# Altium project MCD_Rev2.PrjPcb
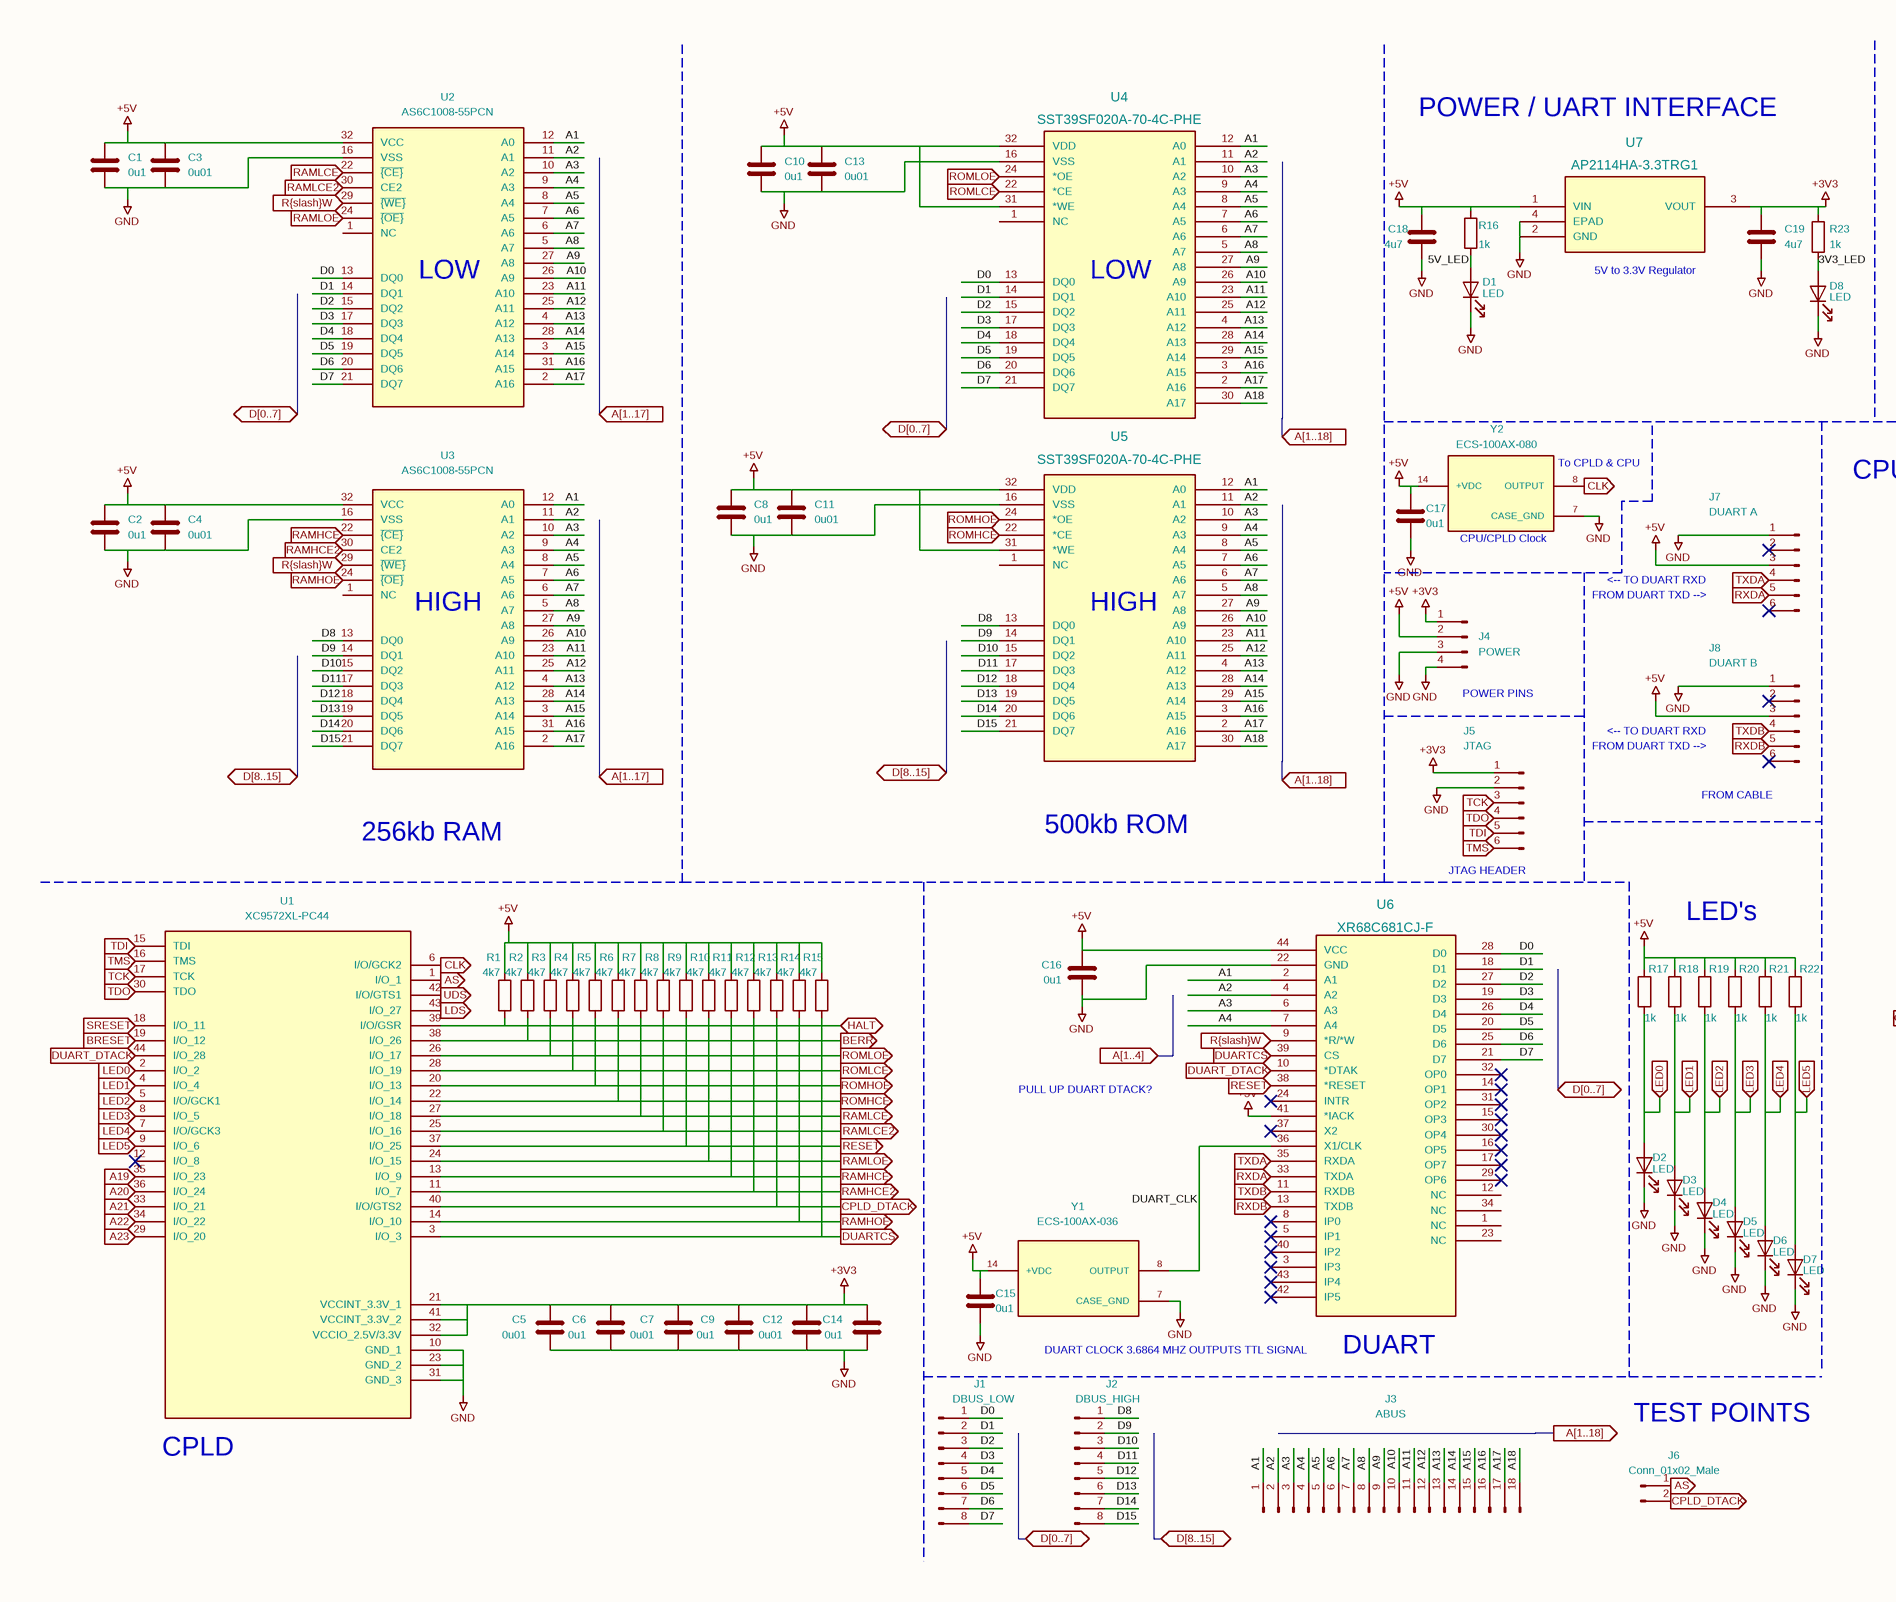
[diagram p0: MCD_Rev2.SchDoc, left]
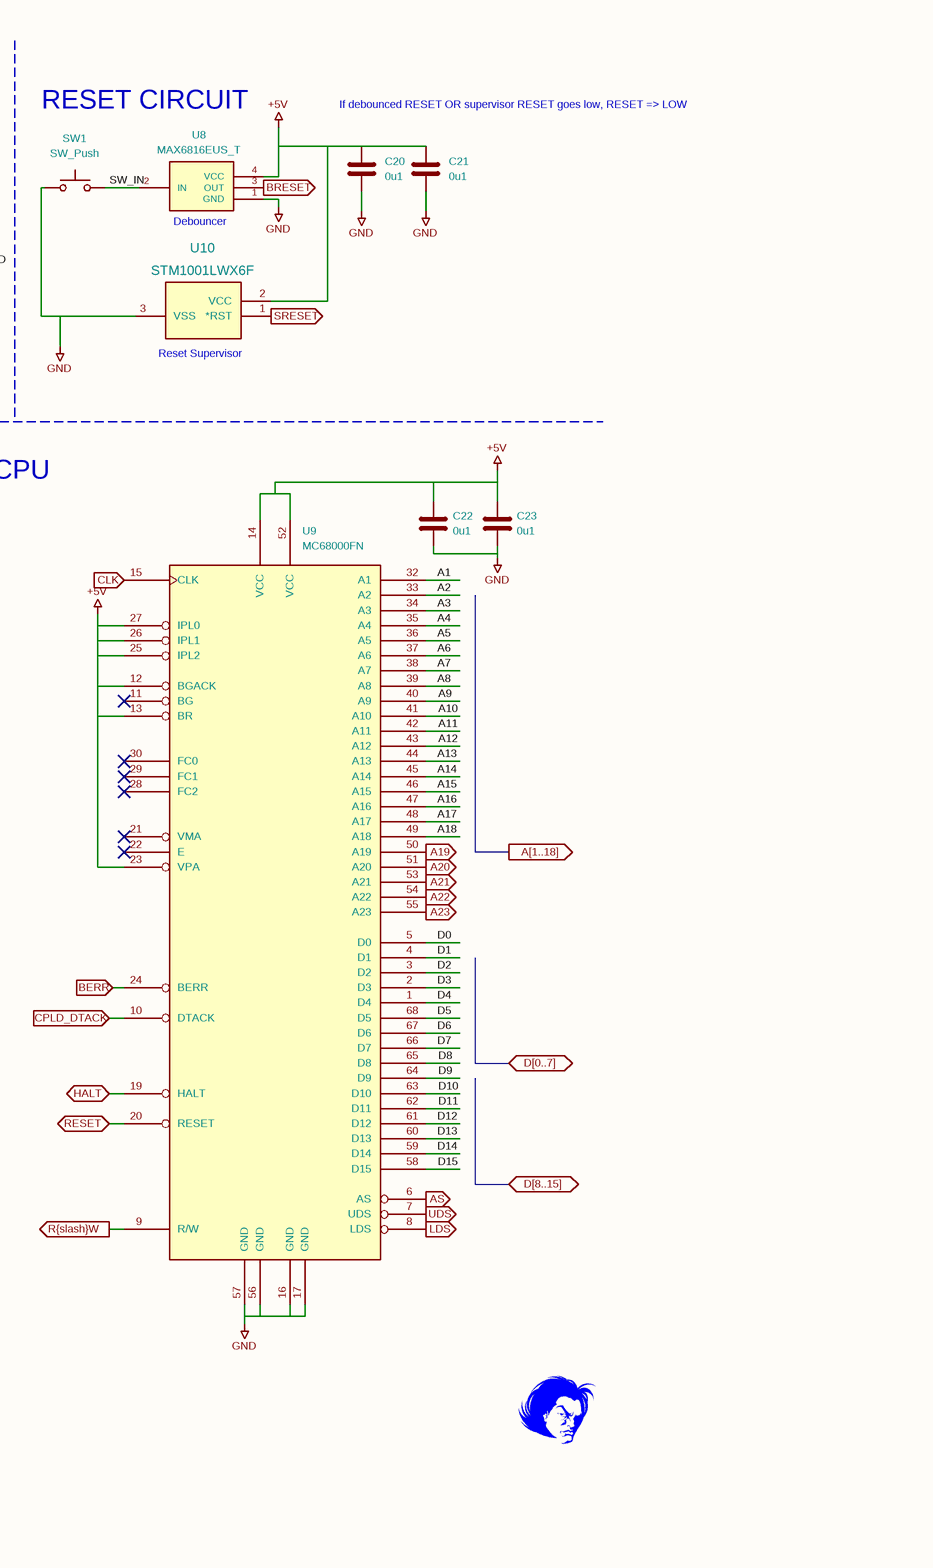
[diagram p1: MCD_Rev2.SchDoc, right]
1 sheet, 75 parts. Net scope: flat (ports and power ports of the same name join across sheets).
Board file: MCD_Rev2.PcbDoc

## Sheet MCD_Rev2.SchDoc
size 431 x 279 mm

### Parts
C1  0u1  [C_0805_2012Metric_Pad1.18x1.45mm_HandSolder]
C2  0u1  [C_0805_2012Metric_Pad1.18x1.45mm_HandSolder]
C3  0u01  [C_0805_2012Metric_Pad1.18x1.45mm_HandSolder]
C4  0u01  [C_0805_2012Metric_Pad1.18x1.45mm_HandSolder]
C5  0u01  [C_0805_2012Metric_Pad1.18x1.45mm_HandSolder]
C6  0u1  [C_0805_2012Metric_Pad1.18x1.45mm_HandSolder]
C7  0u01  [C_0805_2012Metric_Pad1.18x1.45mm_HandSolder]
C8  0u1  [C_0805_2012Metric_Pad1.18x1.45mm_HandSolder]
C9  0u1  [C_0805_2012Metric_Pad1.18x1.45mm_HandSolder]
C10  0u1  [C_0805_2012Metric_Pad1.18x1.45mm_HandSolder]
C11  0u01  [C_0805_2012Metric_Pad1.18x1.45mm_HandSolder]
C12  0u01  [C_0805_2012Metric_Pad1.18x1.45mm_HandSolder]
C13  0u01  [C_0805_2012Metric_Pad1.18x1.45mm_HandSolder]
C14  0u1  [C_0805_2012Metric_Pad1.18x1.45mm_HandSolder]
C15  0u1  [C_0805_2012Metric_Pad1.18x1.45mm_HandSolder]
C16  0u1  [C_0805_2012Metric_Pad1.18x1.45mm_HandSolder]
C17  0u1  [C_0805_2012Metric_Pad1.18x1.45mm_HandSolder]
C18  4u7  [C_0805_2012Metric_Pad1.18x1.45mm_HandSolder]
C19  4u7  [C_0805_2012Metric_Pad1.18x1.45mm_HandSolder]
C20  0u1  [C_0805_2012Metric_Pad1.18x1.45mm_HandSolder]
C21  0u1  [C_0805_2012Metric_Pad1.18x1.45mm_HandSolder]
C22  0u1  [C_0805_2012Metric_Pad1.18x1.45mm_HandSolder]
C23  0u1  [C_0805_2012Metric_Pad1.18x1.45mm_HandSolder]
D1  LED  [LED_0805_2012Metric_Pad1.15x1.40mm_HandSolder]
D2  LED  [LED_0805_2012Metric_Pad1.15x1.40mm_HandSolder]
D3  LED  [LED_0805_2012Metric_Pad1.15x1.40mm_HandSolder]
D4  LED  [LED_0805_2012Metric_Pad1.15x1.40mm_HandSolder]
D5  LED  [LED_0805_2012Metric_Pad1.15x1.40mm_HandSolder]
D6  LED  [LED_0805_2012Metric_Pad1.15x1.40mm_HandSolder]
D7  LED  [LED_0805_2012Metric_Pad1.15x1.40mm_HandSolder]
D8  LED  [LED_0805_2012Metric_Pad1.15x1.40mm_HandSolder]
J1  DBUS_LOW  [CON8_1X8_TU_HTS_SAI]
J2  DBUS_HIGH  [CON8_1X8_TU_HTS_SAI]
J3  ABUS  [CON18_2X9_TU_HTS_SAI]
J4  POWER  [CON4_1X4_TU_HTS_SAI]
J5  JTAG  [CON6_1X6_TU_HTS_SAI]
J6  Conn_01x02_Male  [CON2_1X2_TU_HTS_SAI]
J7  DUART A  [CON6_1X6_TU_HTS_SAI]
J8  DUART B  [CON6_1X6_TU_HTS_SAI]
R1  4k7  [R_0805_2012Metric_Pad1.20x1.40mm_HandSolder]
R2  4k7  [R_0805_2012Metric_Pad1.20x1.40mm_HandSolder]
R3  4k7  [R_0805_2012Metric_Pad1.20x1.40mm_HandSolder]
R4  4k7  [R_0805_2012Metric_Pad1.20x1.40mm_HandSolder]
R5  4k7  [R_0805_2012Metric_Pad1.20x1.40mm_HandSolder]
R6  4k7  [R_0805_2012Metric_Pad1.20x1.40mm_HandSolder]
R7  4k7  [R_0805_2012Metric_Pad1.20x1.40mm_HandSolder]
R8  4k7  [R_0805_2012Metric_Pad1.20x1.40mm_HandSolder]
R9  4k7  [R_0805_2012Metric_Pad1.20x1.40mm_HandSolder]
R10  4k7  [R_0805_2012Metric_Pad1.20x1.40mm_HandSolder]
R11  4k7  [R_0805_2012Metric_Pad1.20x1.40mm_HandSolder]
R12  4k7  [R_0805_2012Metric_Pad1.20x1.40mm_HandSolder]
R13  4k7  [R_0805_2012Metric_Pad1.20x1.40mm_HandSolder]
R14  4k7  [R_0805_2012Metric_Pad1.20x1.40mm_HandSolder]
R15  4k7  [R_0805_2012Metric_Pad1.20x1.40mm_HandSolder]
R16  1k  [R_0805_2012Metric_Pad1.20x1.40mm_HandSolder]
R17  1k  [R_0805_2012Metric_Pad1.20x1.40mm_HandSolder]
R18  1k  [R_0805_2012Metric_Pad1.20x1.40mm_HandSolder]
R19  1k  [R_0805_2012Metric_Pad1.20x1.40mm_HandSolder]
R20  1k  [R_0805_2012Metric_Pad1.20x1.40mm_HandSolder]
R21  1k  [R_0805_2012Metric_Pad1.20x1.40mm_HandSolder]
R22  1k  [R_0805_2012Metric_Pad1.20x1.40mm_HandSolder]
R23  1k  [R_0805_2012Metric_Pad1.20x1.40mm_HandSolder]
SW1  SW_Push  [SW_PUSH_6mm]
U1  XC9572XL-PC44  [TO_11B1-RK-TP_3MM]
U2  AS6C1008-55PCN  [PDIP32_PH_SST_MCH]
U3  AS6C1008-55PCN  [PDIP32_PH_SST_MCH]
U4  SST39SF020A-70-4C-PHE  [PDIP32_PH_SST_MCH]
U5  SST39SF020A-70-4C-PHE  [PDIP32_PH_SST_MCH]
U6  XR68C681CJ-F  [TO_11B1-RK-TP_3MM]
U7  AP2114HA-3.3TRG1  [SOT-223_DIO-L]
U8  MAX6816EUS_T  [SOT-143_Handsoldering]
U9  MC68000FN  [3M_8468-11B1-RK-TP]
U10  STM1001LWX6F  [SOT-23_STM-L]
Y1  ECS-100AX-036  [OSC_ECS-100AX-036]
Y2  ECS-100AX-080  [OSC_ECS-100AX-080]

### Ports
A19 (in), A19 (out), A20 (in), A20 (out), A21 (in), A21 (out), A22 (in), A22 (out), A23 (in), A23 (out), A[1..4] (in), A[1..17] (in), A[1..18] (in), A[1..18] (out), AS (in), AS (out), BERR (in), BERR (out), BRESET (in), BRESET (out), CLK (in), CLK (out), CPLD_DTACK (in), CPLD_DTACK (out), D[0..7] (bidir), D[8..15] (bidir), DUART_DTACK (in), DUART_DTACK (out), DUARTCS (in), DUARTCS (out), HALT (bidir), LDS (in), LDS (out), LED0 (in), LED0 (out), LED1 (in), LED1 (out), LED2 (in), LED2 (out), LED3 (in), LED3 (out), LED4 (in), LED4 (out), LED5 (in), LED5 (out), RAMHCE2 (in), RAMHCE2 (out), RAMHCE (in), RAMHCE (out), RAMHOE (in), RAMHOE (out), RAMLCE2 (in), RAMLCE2 (out), RAMLCE (in), RAMLCE (out), RAMLOE (in), RAMLOE (out), RESET (bidir), RESET (in), RESET (out), ROMHCE (in), ROMHCE (out), ROMHOE (in), ROMHOE (out), ROMLCE (in), ROMLCE (out), ROMLOE (in), ROMLOE (out), RXDA (in), RXDA (out), RXDB (in), RXDB (out), R{slash}W (in), R{slash}W (out), SRESET (in), SRESET (out), TCK (in), TDI (in), TDO (in), TMS (in), TXDA (in), TXDA (out), TXDB (in), TXDB (out), UDS (in), UDS (out)

### Nets
+3V3: C5.1 C6.1 C7.1 C9.1 C12.1 C14.1 C19.1 J4.1(Pin_1) J5.1(Pin_1) R23.1 U1.21(VCCINT_3.3V_1) U1.32(VCCIO_2.5V/3.3V) U1.41(VCCINT_3.3V_2) U7.3(VOUT)
+5V: C1.1 C2.1 C3.1 C4.1 C8.1 C10.1 C11.1 C13.1 C15.1 C16.1 C17.1 C18.1 C20.1 C21.1 C22.1 C23.1 J4.2(Pin_2) J7.3(Pin_3) J8.3(Pin_3) R1.1 R2.1 R3.1 R4.1 R5.1 R6.1 R7.1 R8.1 R9.1 R10.1 R11.1 R12.1 R13.1 R14.1 R15.1 R16.1 R17.1 R18.1 R19.1 R20.1 R21.1 R22.1 U2.32(VCC) U3.32(VCC) U4.31(*WE) U4.32(VDD) U5.31(*WE) U5.32(VDD) U6.41(*IACK) U6.44(VCC) U7.1(VIN) U8.4(VCC) U9.12(BGACK) U9.13(BR) U9.14(VCC) U9.23(VPA) U9.25(IPL2) U9.26(IPL1) U9.27(IPL0) U9.52(VCC) U10.2(VCC) Y1.14(+VDC) Y2.14(+VDC)
GND: C1.2 C2.2 C3.2 C4.2 C5.2 C6.2 C7.2 C8.2 C9.2 C10.2 C11.2 C12.2 C13.2 C14.2 C15.2 C16.2 C17.2 C18.2 C19.2 C20.2 C21.2 C22.2 C23.2 D1.1(K) D2.1(K) D3.1(K) D4.1(K) D5.1(K) D6.1(K) D7.1(K) D8.1(K) J4.3(Pin_3) J4.4(Pin_4) J5.2(Pin_2) J7.1(Pin_1) J8.1(Pin_1) SW1.1 U1.10(GND_1) U1.23(GND_2) U1.31(GND_3) U2.16(VSS) U3.16(VSS) U4.16(VSS) U5.16(VSS) U6.22(GND) U7.2(GND) U7.4(EPAD) U8.1(GND) U9.16(GND) U9.17(GND) U9.56(GND) U9.57(GND) U10.3(VSS) Y1.7(CASE_GND) Y2.7(CASE_GND)
3V3_LED: D8.2(A) R23.2
5V_LED: D1.2(A) R16.2
A1: J3.1(Pin_1) U2.12(A0) U3.12(A0) U4.12(A0) U5.12(A0) U6.2(A1) U9.32(A1)
A2: J3.2(Pin_2) U2.11(A1) U3.11(A1) U4.11(A1) U5.11(A1) U6.4(A2) U9.33(A2)
A3: J3.3(Pin_3) U2.10(A2) U3.10(A2) U4.10(A2) U5.10(A2) U6.6(A3) U9.34(A3)
A4: J3.4(Pin_4) U2.9(A3) U3.9(A3) U4.9(A3) U5.9(A3) U6.7(A4) U9.35(A4)
A5: J3.5(Pin_5) U2.8(A4) U3.8(A4) U4.8(A4) U5.8(A4) U9.36(A5)
A6: J3.6(Pin_6) U2.7(A5) U3.7(A5) U4.7(A5) U5.7(A5) U9.37(A6)
A7: J3.7(Pin_7) U2.6(A6) U3.6(A6) U4.6(A6) U5.6(A6) U9.38(A7)
A8: J3.8(Pin_8) U2.5(A7) U3.5(A7) U4.5(A7) U5.5(A7) U9.39(A8)
A9: J3.9(Pin_9) U2.27(A8) U3.27(A8) U4.27(A8) U5.27(A8) U9.40(A9)
A10: J3.10(Pin_10) U2.26(A9) U3.26(A9) U4.26(A9) U5.26(A9) U9.41(A10)
A11: J3.11(Pin_11) U2.23(A10) U3.23(A10) U4.23(A10) U5.23(A10) U9.42(A11)
A12: J3.12(Pin_12) U2.25(A11) U3.25(A11) U4.25(A11) U5.25(A11) U9.43(A12)
A13: J3.13(Pin_13) U2.4(A12) U3.4(A12) U4.4(A12) U5.4(A12) U9.44(A13)
A14: J3.14(Pin_14) U2.28(A13) U3.28(A13) U4.28(A13) U5.28(A13) U9.45(A14)
A15: J3.15(Pin_15) U2.3(A14) U3.3(A14) U4.29(A14) U5.29(A14) U9.46(A15)
A16: J3.16(Pin_16) U2.31(A15) U3.31(A15) U4.3(A15) U5.3(A15) U9.47(A16)
A17: J3.17(Pin_17) U2.2(A16) U3.2(A16) U4.2(A16) U5.2(A16) U9.48(A17)
A18: J3.18(Pin_18) U4.30(A17) U5.30(A17) U9.49(A18)
A19: U1.35(I/O_23) U9.50(A19) ; port A19
A20: U1.36(I/O_24) U9.51(A20) ; port A20
A21: U1.33(I/O_21) U9.53(A21) ; port A21
A22: U1.34(I/O_22) U9.54(A22) ; port A22
A23: U1.29(I/O_20) U9.55(A23) ; port A23
AS: J6.1(Pin_1) U1.1(I/O_1) U9.6(AS) ; port AS
BERR: R2.2 U1.38(I/O_26) U9.24(BERR) ; port BERR
BRESET: U1.19(I/O_12) U8.3(OUT) ; port BRESET
CLK: U1.6(I/O/GCK2) U9.15(CLK) Y2.8(OUTPUT) ; port CLK
CPLD_DTACK: J6.2(Pin_2) R13.2 U1.40(I/O/GTS2) U9.10(DTACK) ; port CPLD_DTACK
D0: J1.1(Pin_1) U2.13(DQ0) U4.13(DQ0) U6.28(D0) U9.5(D0)
D1: J1.2(Pin_2) U2.14(DQ1) U4.14(DQ1) U6.18(D1) U9.4(D1)
D2: J1.3(Pin_3) U2.15(DQ2) U4.15(DQ2) U6.27(D2) U9.3(D2)
D3: J1.4(Pin_4) U2.17(DQ3) U4.17(DQ3) U6.19(D3) U9.2(D3)
D4: J1.5(Pin_5) U2.18(DQ4) U4.18(DQ4) U6.26(D4) U9.1(D4)
D5: J1.6(Pin_6) U2.19(DQ5) U4.19(DQ5) U6.20(D5) U9.68(D5)
D6: J1.7(Pin_7) U2.20(DQ6) U4.20(DQ6) U6.25(D6) U9.67(D6)
D7: J1.8(Pin_8) U2.21(DQ7) U4.21(DQ7) U6.21(D7) U9.66(D7)
D8: J2.1(Pin_1) U3.13(DQ0) U5.13(DQ0) U9.65(D8)
D9: J2.2(Pin_2) U3.14(DQ1) U5.14(DQ1) U9.64(D9)
D10: J2.3(Pin_3) U3.15(DQ2) U5.15(DQ2) U9.63(D10)
D11: J2.4(Pin_4) U3.17(DQ3) U5.17(DQ3) U9.62(D11)
D12: J2.5(Pin_5) U3.18(DQ4) U5.18(DQ4) U9.61(D12)
D13: J2.6(Pin_6) U3.19(DQ5) U5.19(DQ5) U9.60(D13)
D14: J2.7(Pin_7) U3.20(DQ6) U5.20(DQ6) U9.59(D14)
D15: J2.8(Pin_8) U3.21(DQ7) U5.21(DQ7) U9.58(D15)
DUART_CLK: U6.36(X1/CLK) Y1.8(OUTPUT)
DUART_DTACK: U1.44(I/O_28) U6.10(*DTAK) ; port DUART_DTACK
DUARTCS: R15.2 U1.3(I/O_3) U6.39(CS) ; port DUARTCS
HALT: R1.2 U1.39(I/O/GSR) U9.19(HALT) ; port HALT
LDS: U1.43(I/O_27) U9.8(LDS) ; port LDS
LED0: D2.2(A) R17.2 U1.2(I/O_2) ; port LED0
LED1: D3.2(A) R18.2 U1.4(I/O_4) ; port LED1
LED2: D4.2(A) R19.2 U1.5(I/O/GCK1) ; port LED2
LED3: D5.2(A) R20.2 U1.8(I/O_5) ; port LED3
LED4: D6.2(A) R21.2 U1.7(I/O/GCK3) ; port LED4
LED5: D7.2(A) R22.2 U1.9(I/O_6) ; port LED5
RAMHCE: R11.2 U1.13(I/O_9) U3.22(~{{CE}}) ; port RAMHCE
RAMHCE2: R12.2 U1.11(I/O_7) U3.30(CE2) ; port RAMHCE2
RAMHOE: R14.2 U1.14(I/O_10) U3.24(~{{OE}}) ; port RAMHOE
RAMLCE: R7.2 U1.27(I/O_18) U2.22(~{{CE}}) ; port RAMLCE
RAMLCE2: R8.2 U1.25(I/O_16) U2.30(CE2) ; port RAMLCE2
RAMLOE: R10.2 U1.24(I/O_15) U2.24(~{{OE}}) ; port RAMLOE
RESET: R9.2 U1.37(I/O_25) U6.38(*RESET) U9.20(RESET) ; port RESET
ROMHCE: R6.2 U1.22(I/O_14) U5.22(*CE) ; port ROMHCE
ROMHOE: R5.2 U1.20(I/O_13) U5.24(*OE) ; port ROMHOE
ROMLCE: R4.2 U1.28(I/O_19) U4.22(*CE) ; port ROMLCE
ROMLOE: R3.2 U1.26(I/O_17) U4.24(*OE) ; port ROMLOE
RXDA: J7.5(Pin_5) U6.33(TXDA) ; port RXDA
RXDB: J8.5(Pin_5) U6.13(TXDB) ; port RXDB
R{slash}W: U2.29(~{{WE}}) U3.29(~{{WE}}) U6.9(*R/*W) U9.9(R/W) ; port R{slash}W
SRESET: U1.18(I/O_11) U10.1(*RST) ; port SRESET
SW_IN: SW1.2 U8.2(IN)
TCK: J5.3(Pin_3) U1.17(TCK) ; port TCK
TDI: J5.5(Pin_5) U1.15(TDI) ; port TDI
TDO: J5.4(Pin_4) U1.30(TDO) ; port TDO
TMS: J5.6(Pin_6) U1.16(TMS) ; port TMS
TXDA: J7.4(Pin_4) U6.35(RXDA) ; port TXDA
TXDB: J8.4(Pin_4) U6.11(RXDB) ; port TXDB
UDS: U1.42(I/O/GTS1) U9.7(UDS) ; port UDS

Not connected (* = marked no-connect by the designer): J7 2(Pin_2)* 6(Pin_6)*; J8 2(Pin_2)* 6(Pin_6)*; U1 12(I/O_8)*; U2 1(NC); U3 1(NC); U4 1(NC); U5 1(NC); U6 1(NC) 3(IP3)* 5(IP1)* 8(IP0)* 12(NC) 14(OP1)* 15(OP3)* 16(OP5)* 17(OP7)* 23(NC) 24(INTR)* 29(OP6)* 30(OP4)* 31(OP2)* 32(OP0)* 34(NC) 37(X2)* 40(IP2)* 42(IP5)* 43(IP4)*; U9 11(BG)* 18(NC) 21(VMA)* 22(E)* 28(FC2)* 29(FC1)* 30(FC0)* 31(NC)

### Notes on the sheet
- POWER / UART INTERFACE
- RESET CIRCUIT
- If debounced RESET
  OR supervisor RESET
  goes low, RESET => LOW
- (near U8) Debouncer
- (near U2) LOW
- (near U4) LOW
- (near U7) 5V to 3.3V Regulator
- (near U10) Reset Supervisor
- (near Y2) To CPLD & CPU
- CPU
- (near Y2) CPU/CPLD Clock
- FROM DUART TXD -->
- <-- TO DUART RXD
- (near U3) HIGH
- (near U5) HIGH
- (near J4) POWER PINS
- (near J8) FROM CABLE
- 256kb RAM
- 500kb ROM
- (near J5) JTAG HEADER
- LED's
- PULL UP DUART DTACK?
- DUART CLOCK
  3.6864 MHZ
  OUTPUTS TTL SIGNAL
- (near U6) DUART
- (near J6) TEST POINTS
- (near U1) CPLD
- 1
- 2
- 3
- 4
- 5
- 6
- 7
- 8
- A
- B
- C
- D
- E
- Title: GeorgeOS Single Board Computer
- File: MCD_Rev2.kicad_sch
- Sheet: /
- George Yacoubian
- KiCad E.D.A.  kicad (5.1.4)-1
- Size: B
- Date:
- Rev: 2
- Id: 1/1

### Library data of the parts
C1-C23 = C: Footprint: Capacitor_SMD:C_0805_2012Metric_Pad1.18x1.45mm_HandSolder
  C1 C2 C6 C8-C10 C14-C17 C20-C23: Value: 0u1
  C3-C5 C7 C11-C13: Value: 0u01
  C18 C19: Value: 4u7
J1 J2 = Conn_01x08_Male: Footprint: Imported:CON8_1X8_TU_HTS_SAI
  J1: Value: DBUS_LOW
  J2: Value: DBUS_HIGH
J3 = Conn_01x18_Male: Value: ABUS; Footprint: Imported:CON18_2X9_TU_HTS_SAI
J4 = Conn_01x04_Male: Value: POWER; Footprint: Imported:CON4_1X4_TU_HTS_SAI
J5 J7 J8 = Conn_01x06_Male: Footprint: Imported:CON6_1X6_TU_HTS_SAI
  J5: Value: JTAG
  J7: Value: DUART A
  J8: Value: DUART B
R1-R23 = R: Footprint: Resistor_SMD:R_0805_2012Metric_Pad1.20x1.40mm_HandSolder
  R1-R15: Value: 4k7
  R16-R23: Value: 1k
U2 U3 = AS6C1008-55PCN: MANUFACTURER: Alliance Memory, Inc.; SNAPEDA_PACKAGE_ID: 10893; MAXIMUM_PACKAGE_HEIGHT: 4.191 mm; STANDARD: IPC 7351B; PARTREV: v1.0; SNAPEDA_PN: AS6C1008-55PCN; Value: AS6C1008-55PCN; Footprint: Imported:PDIP32_PH_SST_MCH
U4 U5 = SST39SF020A-70-4C-PHE_1: Value: SST39SF020A-70-4C-PHE; Footprint: Imported:PDIP32_PH_SST_MCH
U8 = MAX6816EUS_T_1: Manufacturer: Maxim Integrated; Package: SOT192P237X122-4N; Value: MAX6816EUS_T; Footprint: Package_TO_SOT_SMD:SOT-143_Handsoldering
U10 = STM1001SWX6F_1: Value: STM1001LWX6F; Footprint: Imported:SOT-23_STM-L
Y1 = ECS-100AX-036: MANUFACTURER: ECS Inc.; STANDARD: MANUFACTURER RECOMMENDATIONS; Value: ECS-100AX-036; Footprint: Imported:OSC_ECS-100AX-036
Y2 = ECS-100AX-080: MANUFACTURER: ECS Inc.; STANDARD: MANUFACTURER RECOMMENDATIONS; Value: ECS-100AX-080; Footprint: Imported:OSC_ECS-100AX-080
D1-D8 = LED: Value: LED; Footprint: LED_SMD:LED_0805_2012Metric_Pad1.15x1.40mm_HandSolder
J6 = Conn_01x02_Male: Value: Conn_01x02_Male; Footprint: Imported:CON2_1X2_TU_HTS_SAI
SW1 = SW_Push: Value: SW_Push; Footprint: Button_Switch_THT:SW_PUSH_6mm
U1 = XC9572XL-PC44: Value: XC9572XL-PC44; Footprint: Imported:TO_11B1-RK-TP_3MM
U6 = XR68C681CJ-F: Value: XR68C681CJ-F; Footprint: Imported:TO_11B1-RK-TP_3MM
U7 = AP2114HA-3.3TRG1: Value: AP2114HA-3.3TRG1; Footprint: Imported:SOT-223_DIO-L
U9 = MC68000FN: Value: MC68000FN; Footprint: Imported:3M_8468-11B1-RK-TP